# Altium schematic sheet DDS.SchDoc
size A4
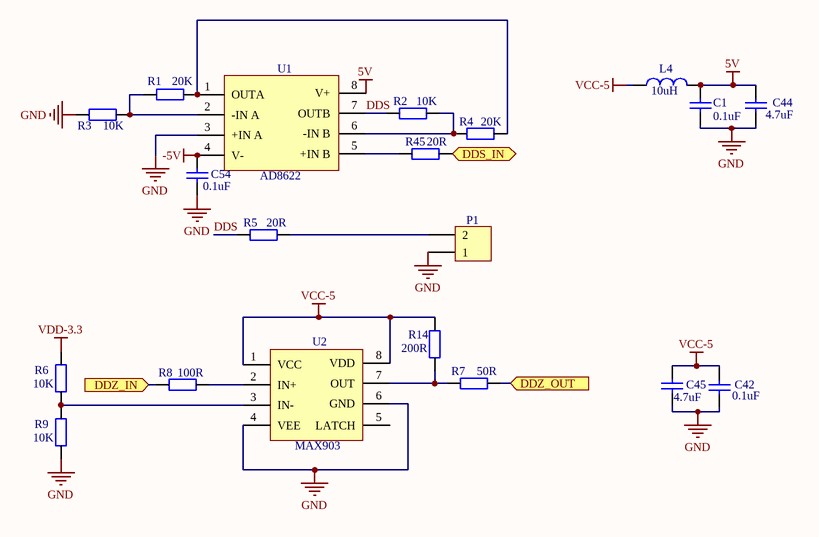
[diagram p0: DDS.SchDoc]

## Parts
C1  value 0.1uF  [0603]  (hidden comment: Capacitor-0603)
C42  value 0.1uF  [0603]  (hidden comment: Capacitor-0603)
C44  value 4.7uF  [0603]  (hidden comment: Capacitor-0603)
C45  value 4.7uF  [0603]  (hidden comment: Capacitor-0603)
C54  value 0.1uF  [0603]  (hidden comment: Capacitor-0603)
L4  value 10uH  [0805]  (hidden comment: Inductor)
P1  端子  [2MM接线端子]  (value not drawn)
R1  value 20K  [0603]  (hidden comment: Resistor-0603)
R2  value 10K  [0603]  (hidden comment: Resistor-0603)
R3  value 10K  [0603]  (hidden comment: Resistor-0603)
R4  value 20K  [0603]  (hidden comment: Resistor-0603)
R5  value 20R  [0603]  (hidden comment: Resistor-0603)
R6  value 10K  [0603]  (hidden comment: Resistor-0805)
R7  value 50R  [0603]  (hidden comment: Resistor-0603)
R8  value 100R  [0603]  (hidden comment: Resistor-0603)
R9  value 10K  [0603]  (hidden comment: Resistor-0805)
R14  value 200R  [0603]  (hidden comment: Resistor-0603)
R45  value 20R  [0603]  (hidden comment: Resistor-0603)
U1  AD8622  [LM358-D]
U2  MAX903  [LM358-D]

## Ports
DDS_IN (in), DDZ_IN (in), DDZ_OUT (in)

## Nets
5V: C1.1 C44.1 L4.2 U1.8(V+)
-5V: C54.1 U1.4(V-)
GND: C1.2 C42.2 C44.2 C45.2 C54.2 P1.1 R3.2 R9.1 U1.3(+IN_A) U2.4(VEE) U2.6(GND)
VCC-5: C42.1 C45.1 L4.1 R14.1 U2.1(VCC) U2.8(VDD)
VDD-3.3: R6.2
DDS: R2.2 R5.2 U1.7(OUTB)
DDS_IN: R45.1 ; port DDS_IN
DDZ_IN: R8.2 ; port DDZ_IN
DDZ_OUT: R7.1 ; port DDZ_OUT
NetP1_2: P1.2 R5.1
NetR1_1: R1.1 R4.1 U1.1(OUTA)
NetR1_2: R1.2 R3.1 U1.2(-IN_A)
NetR2_1: R2.1 R4.2 U1.6(-IN_B)
NetR6_1: R6.1 R9.2 U2.3(IN-)
NetR7_2: R7.2 R14.2 U2.7(OUT)
NetR8_1: R8.1 U2.2(IN+)
NetR45_2: R45.2 U1.5(+IN_B)

Not connected (* = marked no-connect by the designer): U2 5(LATCH)

## Library data of the parts
R6 R9 = Resistor-0
U1 = AD8622: Name: AD8622
U2 = MAX903: Name: MAX903